# EAGLE design Hub_02 (EAGLE 9.6.2)
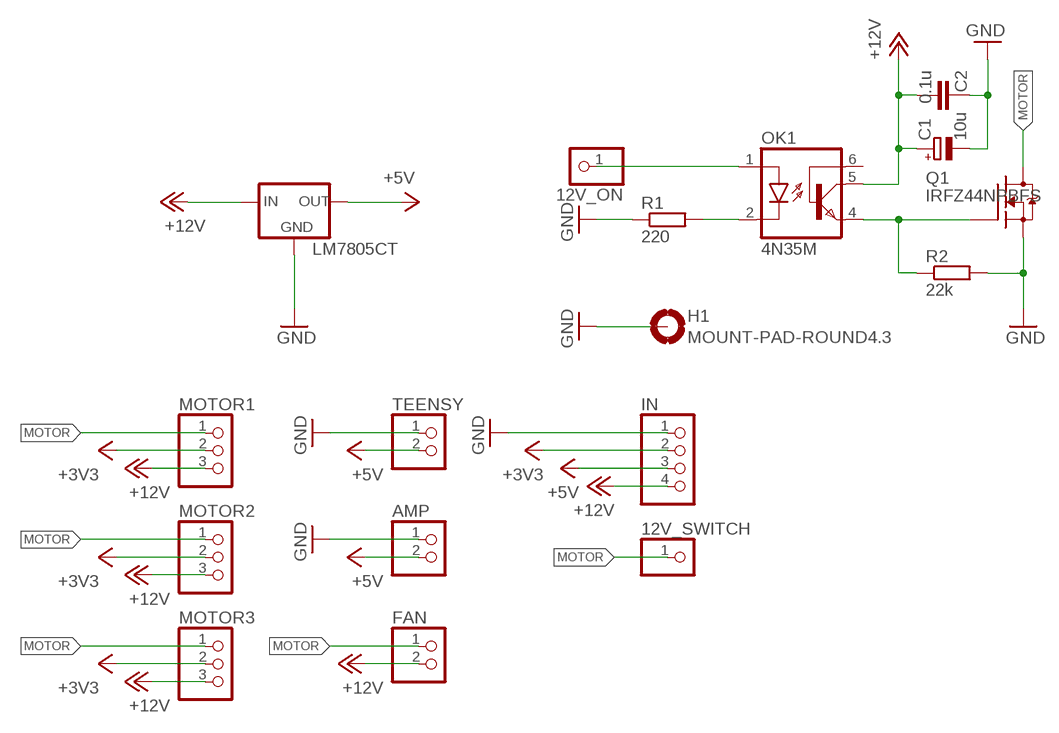
[diagram p0: schematic, sheet 1]

## Parts
12V_ON  PINHD-1X1  [1X01]
12V_SWITCH  PINHD-1X1  [1X01]
AMP  PINHD-1X2  [1X02]
C1  10u  CPOL-EUE2,5-6E  [E2,5-6E]
C2  0.1u  C-EU025-024X044  [C025-024X044]
FAN  PINHD-1X2  [1X02]
H1  MOUNT-PAD-ROUND4.3  [4,3-PAD]
IN  PINHD-1X4  [1X04]
LM7805CT  78XXS  [78XXS]
MOTOR1  PINHD-1X3  [1X03]
MOTOR2  PINHD-1X3  [1X03]
MOTOR3  PINHD-1X3  [1X03]
OK1  4N35M  [DIL06]
Q1  IRFZ44NPBFS  [TO220-3S]
R1  220  R-EU_0204/7  [0204/7]
R2  22k  R-EU_0204/7  [0204/7]
TEENSY  PINHD-1X2  [1X02]

## Nets
+3V3: IN.2 MOTOR1.2 MOTOR2.2 MOTOR3.2
+5V [5V]: AMP.2 IN.3 LM7805CT.OUT TEENSY.2
+12V [12V]: C1.+ C2.2 FAN.2 IN.4 LM7805CT.IN MOTOR1.3 MOTOR2.3 MOTOR3.3 OK1.5(COL)
GND [GND]: AMP.1 C1.- C2.1 H1.B4,3(MOUNT) IN.1 LM7805CT.GND Q1.S R1.1 R2.2 TEENSY.1
MOTOR [GND]: 12V_SWITCH.1 FAN.1 MOTOR1.1 MOTOR2.1 MOTOR3.1 Q1.D
N$1: OK1.2(C) R1.2
N$3: OK1.4(EMI) Q1.G R2.1
N$4: 12V_ON.1 OK1.1(A)
Unconnected: OK1.6(BAS)

## Library data of the parts
12V_ON 12V_SWITCH = pinhead:PINHD-1X1: PIN HEADER
AMP FAN TEENSY = pinhead:PINHD-1X2: PIN HEADER
C1 = rcl:CPOL-EU: POLARIZED CAPACITOR, European symbol; SPICEPREFIX: C
C2 = rcl:C-EU: CAPACITOR, European symbol; SPICEPREFIX: C
H1 = holes:MOUNT-PAD-ROUND: MOUNTING PAD, round
IN = pinhead:PINHD-1X4: PIN HEADER
LM7805CT = v-reg:78XXS: VOLTAGE REGULATOR
MOTOR1-MOTOR3 = pinhead:PINHD-1X3: PIN HEADER
OK1 = optocoupler:4N*?M: General Purpose 6-Pin Phototransistor Optocouplers Source: http://www.fairchildsemi.com/ds/4N/4N35-M.pdf; MPN: 4N35-M; OC_FARNELL: 1021351; OC_NEWARK: 98K9114
Q1 = Programmer:IRFZ44NPBF
R1 R2 = rcl:R-EU_: RESISTOR, European symbol; SPICEPREFIX: R

## Net classes
0 3V3: width 0.203 mm, drill 0.203 mm, clearance 0.203 mm
1 GND: width 0.203 mm, clearance 0.203 mm
2 12V: width 0.813 mm, clearance 0.406 mm
3 5V: width 0.406 mm, clearance 0.203 mm

## Board
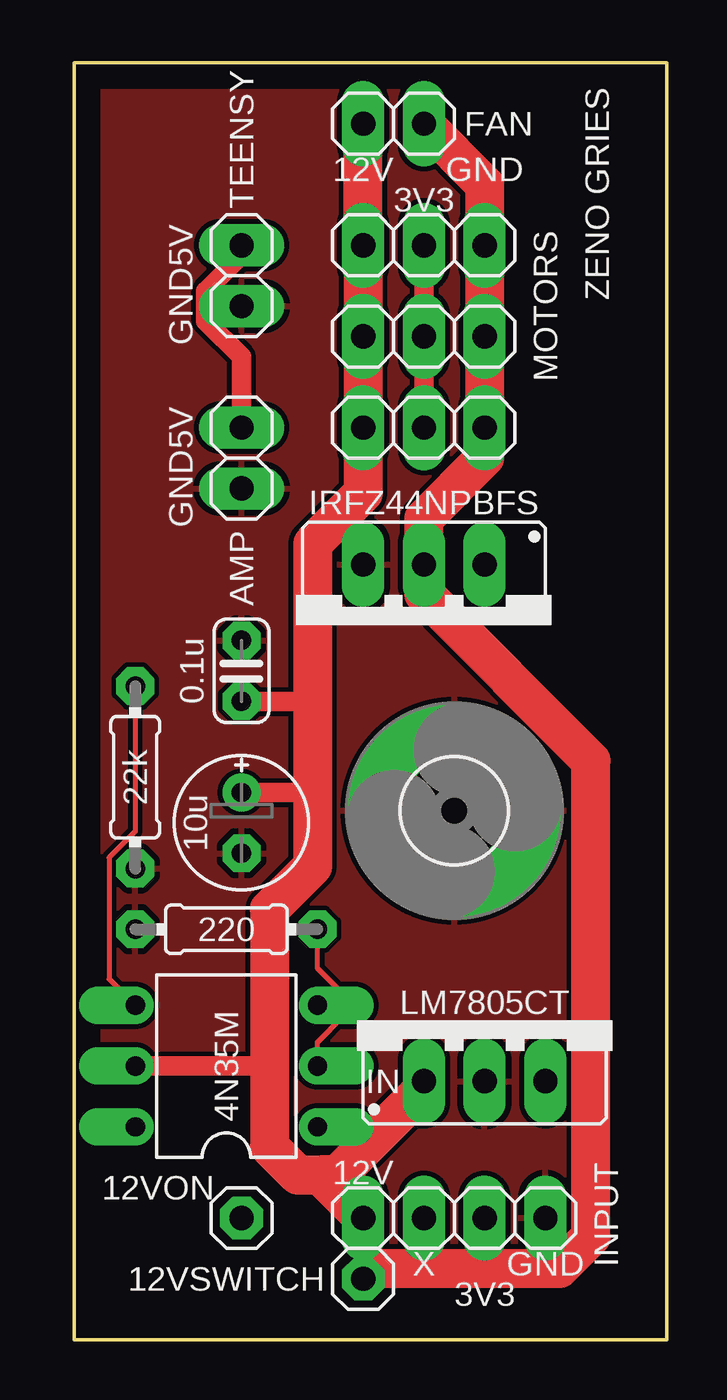
[diagram p1: board, top side]
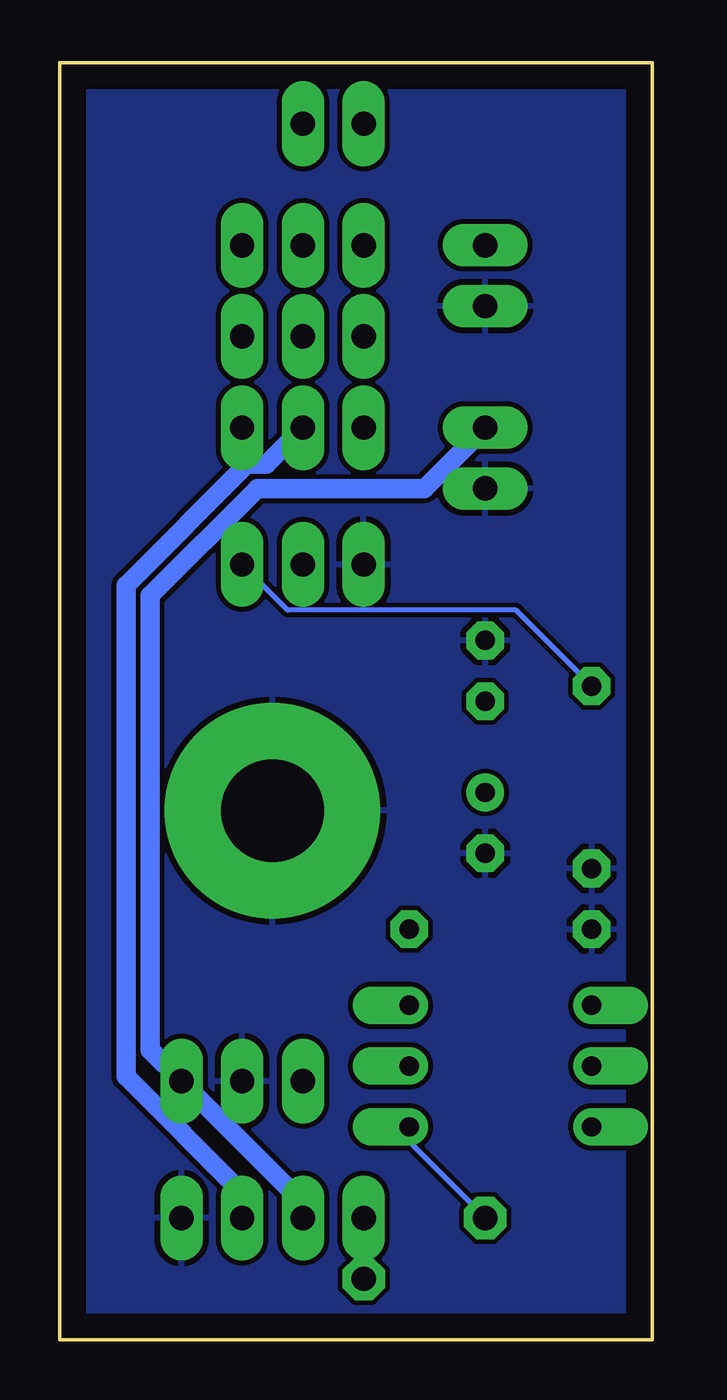
[diagram p2: board, bottom side, seen from below]

Size 24.77 x 53.34 mm. Coordinates in mm from the lower left corner, seen from the top.
Outline: 0,0 0,53.34 24.77,53.34 24.77,0 0,0
Copper layers (1*16): Top 0.035mm / dielectric 1.5mm / Bottom 0.035mm
Design rules "default *": minimum track width 6mil, minimum drill 0.35mm, track to track 6mil, track to pad 6mil, pad to pad 6mil, via to via 6mil, smd to smd 6mil, copper to edge 40mil, drill to drill 6mil, minimum pad ring 15mil, minimum via ring 8mil, stop-mask expansion 4mil, vias tented up to drill 0mil, thermal gap 10mil

### Footprints (pad centres in the part's own frame; a part is rotated, then mirrored left to right if it is on the bottom)
1X01 = drill 1.016 octagon: 1 0,0
1X02 = drill 1.016 long: 1 -1.27,0; 2 1.27,0
E2,5-6E = drill 0.813 pad 1.575: + -1.27,0 | drill 0.813 pad 1.575 octagon: - 1.27,0
C025-024X044 = drill 0.813 octagon: 1 -1.27,0; 2 1.27,0
4,3-PAD = drill 4.3 pad 9: B4,3 0,0
1X04 = drill 1.016 long: 1 -3.81,0; 2 -1.27,0; 3 1.27,0; 4 3.81,0
78XXS = drill 1.016 long: GND 0,-2.54; IN -2.54,-2.54; OUT 2.54,-2.54
1X03 = drill 1.016 long: 1 -2.54,0; 2 0,0; 3 2.54,0
DIL06 = drill 0.813 offset: 1 -2.54,-3.81; 2 0,-3.81; 3 2.54,-3.81; 4 2.54,3.81; 5 0,3.81; 6 -2.54,3.81
TO220-3S = drill 1.016 long: D 0,-2.54; G -2.54,-2.54; S 2.54,-2.54
0204/7 = drill 0.813 octagon: 1 -3.81,0; 2 3.81,0

### Placement (x,y rotation side)
12V_ON  6.99,5.08 0 top
12V_SWITCH  12.07,2.54 0 top
AMP  6.99,36.83 90 top
C1  6.99,21.59 270 top
C2  6.99,27.94 270 top
FAN  13.34,50.8 180 top
H1  15.88,22.1 0 top
IN  15.88,5.08 180 top
LM7805CT  17.15,13.34 0 top
MOTOR1  14.61,45.72 180 top
MOTOR2  14.61,41.91 180 top
MOTOR3  14.61,38.1 180 top
OK1  6.35,11.43 90 top
Q1  14.61,29.84 180 top
R1  6.35,17.14 0 top
R2  2.54,23.49 270 top
TEENSY  6.99,44.45 90 top

### Tracks (layer width: path | path; a pad name or v marks a point on that pad's centre or on a via)
+3V3
  Top 0.813: MOTOR1.2 MOTOR2.2 MOTOR3.2
  Bottom 0.813: MOTOR3.2 16.13,36.58 16.93,36.58 22,31.51 22,10.99 17.15,6.14 IN.2
+5V
  Top 0.813: AMP.2 6.99,41.06 5.49,42.56 5.49,43.8 6.99,45.3 TEENSY.2
  Bottom 0.813: AMP.2 9.53,35.56 16.51,35.56 20.98,31.09 20.98,12.11 19.69,10.81 LM7805CT.OUT 14.61,5.71 IN.3
+12V
  Top 0.813: OK1.5 8.15,11.43 | C1.+ 9.96,22.86 | C2.2 9.96,26.67
  Top 1.626: FAN.2 MOTOR1.3 MOTOR2.3 MOTOR3.3 12.07,35.37 9.96,33.26 9.96,26.67 9.96,22.86 9.96,19.78 8.15,17.98 8.15,11.43 8.15,8.06 9.33,6.88 10.26,6.88 | 10.26,6.88 IN.4 | LM7805CT.IN 14.61,10.5 10.99,6.88 10.26,6.88
GND
  pour Top: 0,0 0,53.34 24.77,53.34 24.77,0
  pour Bottom: 0,0 0,53.34 24.77,53.34 24.77,0
MOTOR
  Top 1.626: FAN.1 17.15,48.26 MOTOR1.1 MOTOR2.1 MOTOR3.1 17.15,36.83 14.61,34.29 Q1.D 14.61,31.17 21.59,24.18 21.59,4.29 20.27,2.97 12.5,2.97 12V_SWITCH.1
N$1
  Top 0.203: OK1.2 10.16,12.43 11.25,13.52 11.25,14.42 10.16,15.52 R1.2
N$3
  Top 0.203: R2.1 2.54,21.23 1.45,20.14 1.45,15.06 OK1.4
  Bottom 0.203: R2.1 5.72,30.48 15.24,30.48 Q1.G
N$4
  Bottom 0.203: 12V_ON.1 10.16,8.25 OK1.1

### Text on the board
tPlace: ZENO GRIES
tNames: 12V | GND | 3V3 | 5V | GND | MOTORS | 5V | GND | IN | 12VON | 12V | INPUT | X | GND | 12VSWITCH | 3V3